# EAGLE design OSO-FEAL-A1-00 (EAGLE 9.6.2)
COMPANY: ADAFRUIT INDUSTRIES; DRAWN: KTOWN; REV: B
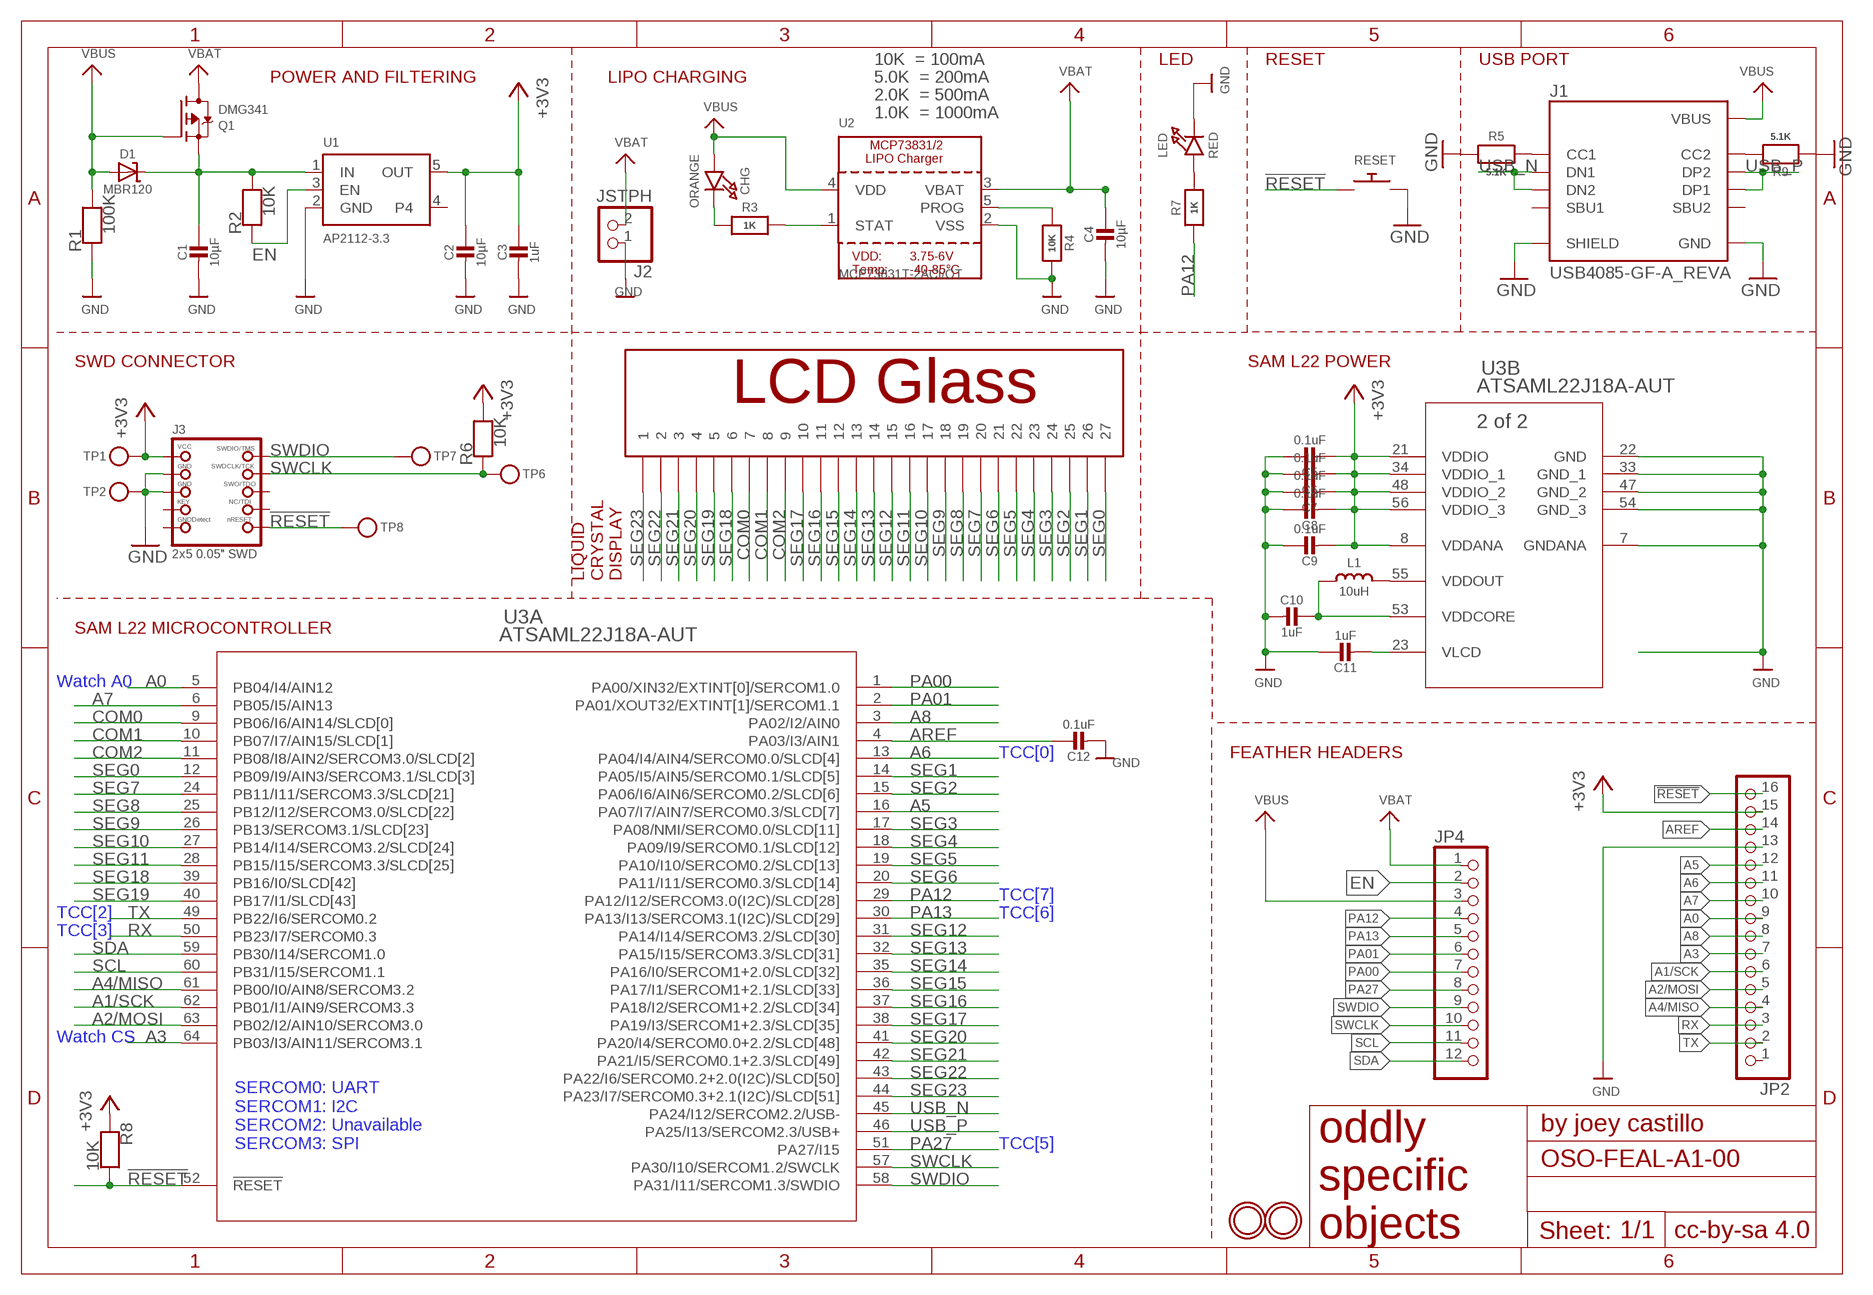
[diagram p0: schematic, sheet 1]

## Parts
C1  10µF  CAP_CERAMIC_1206  [_1206]
C2  10µF  CAP_CERAMIC_1206  [_1206]
C3  1uF  CAP_CERAMIC_1206  [_1206]
C4  10µF  CAP_CERAMIC_1206  [_1206]
C5  0.1uF  CAP_CERAMIC0603_NO  [0603-NO]
C6  0.1uF  CAP_CERAMIC0603_NO  [0603-NO]
C7  0.1uF  CAP_CERAMIC0603_NO  [0603-NO]
C8  0.1uF  CAP_CERAMIC0603_NO  [0603-NO]
C9  0.1uF  CAP_CERAMIC0603_NO  [0603-NO]
C10  1uF  CAP_CERAMIC_1206  [_1206]
C11  1uF  CAP_CERAMIC_1206  [_1206]
C12  0.1uF  CAP_CERAMIC0603_NO  [0603-NO]
CHG  ORANGE  LED0805_NOOUTLINE  [CHIPLED_0805_NOOUTLINE]
D1  MBR120  DIODE-SCHOTTKYSOD-123  [SOD-123]
J1  USB4085-GF-A_REVA  [GCT_USB4085-GF-A_REVA]
J2  JSTPH  CON_JST_PH_2PIN  [JSTPH2]
J3  2x5 0.05" SWD  JTAG-CORTEXBOX  [2X05_1.27MM_BOX_NOPOSTS]
JP2  HEADER-1X16_MIN  [1X16_ROUND_MIN]
JP4  HEADER-1X12_MIN  [1X12_ROUND_MIN]
L1  10uH  MICROBUILDER_INDUCTOR_0805MP  [MICROBUILDER__0805MP]
LED  RED  LED0805_NOOUTLINE  [CHIPLED_0805_NOOUTLINE]
Q1  DMG341  MOSFET-P  [SOT23-R]
R1  100K  RESISTOR_0603_NOOUT  [0603-NO]
R2  10K  RESISTOR_0603_NOOUT  [0603-NO]
R3  1K  RESISTOR_0603_NOOUT  [0603-NO]
R4  10K  RESISTOR_0603_NOOUT  [0603-NO]
R5  5.1K  RESISTOR_0603_NOOUT  [0603-NO]
R6  10K  RESISTOR_0603_NOOUT  [0603-NO]
R7  1K  RESISTOR_0603_NOOUT  [0603-NO]
R8  10K  RESISTOR_0603_NOOUT  [0603-NO]
R9  5.1K  RESISTOR_0603_NOOUT  [0603-NO]
RESET  SWITCH_PUSHBUTTON_3.5X6MM  [TACTILE_3X6MM]
TP1  TESTPOINTROUND2MMNO  [TESTPOINT_ROUND_2MM_NO]
TP2  TESTPOINTROUND2MMNO  [TESTPOINT_ROUND_2MM_NO]
TP6  TESTPOINTROUND2MMNO  [TESTPOINT_ROUND_2MM_NO]
TP7  TESTPOINTROUND2MMNO  [TESTPOINT_ROUND_2MM_NO]
TP8  TESTPOINTROUND2MMNO  [TESTPOINT_ROUND_2MM_NO]
U1  AP2112-3.3  VREG_SOT23-5  [SOT23-5]
U2  MCP73831T-2ACI/OT  MCP73831/2  [SOT23-5]
U3  ATSAML22J18A-AUT  [TQFP64_10X10MC_MCH-L]
U$4  LCD_FEATHER_DISPLAY  [LCD_FEATHER_DISPLAY]
U$31  MOUNTINGHOLE2.5  [MOUNTINGHOLE_2.5_PLATED]
U$32  MOUNTINGHOLE2.5  [MOUNTINGHOLE_2.5_PLATED]

## Nets
!RESET: J3.10(NRESET) JP2.16 R8.2 RESET.P$1 TP8.P$1 U3.52(A:!RESET)
+3V3 [power]: C2.1 C3.1 C5.2 C6.2 C7.2 C8.2 C9.2 J3.1(VCC) JP2.15 R6.2 R8.1 TP1.P$1 U1.5(OUT) U3.8(B:VDDANA) U3.21(B:VDDIO) U3.34(B:VDDIO_1) U3.48(B:VDDIO_2) U3.56(B:VDDIO_3)
A0: JP2.9 U3.5(A:PB04/I4/AIN12)
A1/SCK: JP2.6 U3.62(A:PB01/I1/AIN9/SERCOM3.3)
A2/MOSI: JP2.5 U3.63(A:PB02/I2/AIN10/SERCOM3.0)
A3: JP2.7 U3.64(A:PB03/I3/AIN11/SERCOM3.1)
A4/MISO: JP2.4 U3.61(A:PB00/I0/AIN8/SERCOM3.2)
A5: JP2.12 U3.16(A:PA07/I7/AIN7/SERCOM0.3/SLCD[7])
A6: JP2.11 U3.13(A:PA04/I4/AIN4/SERCOM0.0/SLCD[4])
A7: JP2.10 U3.6(A:PB05/I5/AIN13)
A8: JP2.8 U3.3(A:PA02/I2/AIN0)
AREF: C12.1 JP2.14 U3.4(A:PA03/I3/AIN1)
CHG: CHG.C R3.1
COM0 [lcd]: U3.9(A:PB06/I6/AIN14/SLCD[0]) U$4.P$7
COM1 [lcd]: U3.10(A:PB07/I7/AIN15/SLCD[1]) U$4.P$8
COM2 [lcd]: U3.11(A:PB08/I8/AIN2/SERCOM3.0/SLCD[2]) U$4.P$9
EN: JP4.2 R2.1 U1.3(EN)
GND [gnd]: C1.2 C2.2 C3.2 C4.2 C5.1 C6.1 C7.1 C8.1 C9.1 C10.2 C11.1 C12.2 J1.A1(GND) J1.A12(GND) J1.B1(GND) J1.B12(GND) J1.P1(SHIELD) J1.P2(SHIELD) J1.P3(SHIELD) J1.P4(SHIELD) J2.1 J3.3(GND) J3.5(GND) JP2.13 LED.C R1.1 R4.2 R5.1 R9.2 RESET.P$2 TP2.P$1 U1.2(GND) U2.2(VSS) U3.7(B:GNDANA) U3.22(B:GND) U3.33(B:GND_1) U3.47(B:GND_2) U3.54(B:GND_3)
N$1: LED.A R7.2
N$2: J1.A5(CC1) R5.2
N$3: J1.B5(CC2) R9.1
PA00: JP4.7 U3.1(A:PA00/XIN32/EXTINT[0]/SERCOM1.0)
PA01: JP4.6 U3.2(A:PA01/XOUT32/EXTINT[1]/SERCOM1.1)
PA12: JP4.4 R7.1 U3.29(A:PA12/I12/SERCOM3.0(I2C)/SLCD[28])
PA13: JP4.5 U3.30(A:PA13/I13/SERCOM3.1(I2C)/SLCD[29])
PA27: JP4.8 U3.51(A:PA27/I15)
PROG: R4.1 U2.5(PROG)
RX: JP2.3 U3.50(A:PB23/I7/SERCOM0.3)
SCL: JP4.11 U3.60(A:PB31/I15/SERCOM1.1)
SDA: JP4.12 U3.59(A:PB30/I14/SERCOM1.0)
SEG0 [lcd]: U3.12(A:PB09/I9/AIN3/SERCOM3.1/SLCD[3]) U$4.P$27
SEG1 [lcd]: U3.14(A:PA05/I5/AIN5/SERCOM0.1/SLCD[5]) U$4.P$26
SEG2 [lcd]: U3.15(A:PA06/I6/AIN6/SERCOM0.2/SLCD[6]) U$4.P$25
SEG3 [lcd]: U3.17(A:PA08/NMI/SERCOM0.0/SLCD[11]) U$4.P$24
SEG4 [lcd]: U3.18(A:PA09/I9/SERCOM0.1/SLCD[12]) U$4.P$23
SEG5 [lcd]: U3.19(A:PA10/I10/SERCOM0.2/SLCD[13]) U$4.P$22
SEG6 [lcd]: U3.20(A:PA11/I11/SERCOM0.3/SLCD[14]) U$4.P$21
SEG7 [lcd]: U3.24(A:PB11/I11/SERCOM3.3/SLCD[21]) U$4.P$20
SEG8 [lcd]: U3.25(A:PB12/I12/SERCOM3.0/SLCD[22]) U$4.P$19
SEG9 [lcd]: U3.26(A:PB13/SERCOM3.1/SLCD[23]) U$4.P$18
SEG10 [lcd]: U3.27(A:PB14/I14/SERCOM3.2/SLCD[24]) U$4.P$17
SEG11 [lcd]: U3.28(A:PB15/I15/SERCOM3.3/SLCD[25]) U$4.P$16
SEG12 [lcd]: U3.31(A:PA14/I14/SERCOM3.2/SLCD[30]) U$4.P$15
SEG13 [lcd]: U3.32(A:PA15/I15/SERCOM3.3/SLCD[31]) U$4.P$14
SEG14 [lcd]: U3.35(A:PA16/I0/SERCOM1+2.0/SLCD[32]) U$4.P$13
SEG15 [lcd]: U3.36(A:PA17/I1/SERCOM1+2.1/SLCD[33]) U$4.P$12
SEG16 [lcd]: U3.37(A:PA18/I2/SERCOM1+2.2/SLCD[34]) U$4.P$11
SEG17 [lcd]: U3.38(A:PA19/I3/SERCOM1+2.3/SLCD[35]) U$4.P$10
SEG18 [lcd]: U3.39(A:PB16/I0/SLCD[42]) U$4.P$6
SEG19 [lcd]: U3.40(A:PB17/I1/SLCD[43]) U$4.P$5
SEG20 [lcd]: U3.41(A:PA20/I4/SERCOM0.0+2.2/SLCD[48]) U$4.P$4
SEG21 [lcd]: U3.42(A:PA21/I5/SERCOM0.1+2.3/SLCD[49]) U$4.P$3
SEG22 [lcd]: U3.43(A:PA22/I6/SERCOM0.2+2.0(I2C)/SLCD[50]) U$4.P$2
SEG23 [lcd]: U3.44(A:PA23/I7/SERCOM0.3+2.1(I2C)/SLCD[51]) U$4.P$1
STAT: R3.2 U2.1(STAT)
SWCLK: J3.4(SWDCLK) JP4.10 R6.1 TP6.P$1 U3.57(A:PA30/I10/SERCOM1.2/SWCLK)
SWDIO: J3.2(SWDIO) JP4.9 TP7.P$1 U3.58(A:PA31/I11/SERCOM1.3/SWDIO)
TX: JP2.2 U3.49(A:PB22/I6/SERCOM0.2)
USB_N: J1.A7(DN1) J1.B7(DN2) U3.45(A:PA24/I12/SERCOM2.2/USB-)
USB_P: J1.A6(DP1) J1.B6(DP2) U3.46(A:PA25/I13/SERCOM2.3/USB+)
VBAT [power]: C4.1 J2.2 JP4.1 Q1.3(D) U2.3(VBAT)
VBUS [power]: CHG.A D1.A J1.A4(VBUS) J1.A9(VBUS) J1.B4(VBUS) J1.B9(VBUS) JP4.3 Q1.1(G) R1.2 U2.4(VDD)
VDDCORE [power]: C10.1 L1.1 U3.53(B:VDDCORE)
VDDOUT [power]: L1.2 U3.55(B:VDDOUT)
VHI [power]: C1.1 D1.C Q1.2(S) R2.2 U1.1(IN)
VLCD: C11.2 U3.23(B:VLCD)
Unconnected: J1.A8(SBU1) J1.B8(SBU2) J3.6(SWO) J3.7(KEY) J3.8(TDI) J3.9(GNDDETECT) JP2.1 U1.4

## Notes on the sheet
- 10K  = 100mA | LED | RESET | USB PORT
- POWER AND FILTERING | LIPO CHARGING | 5.0K  = 200mA
- 2.0K  = 500mA
- 1.0K  = 1000mA
- SWD CONNECTOR | SAM L22 POWER
- LIQUID
  CRYSTAL
  DISPLAY
- SAM L22 MICROCONTROLLER
- Watch A0
- TCC[0] | FEATHER HEADERS
- TCC[7]
  TCC[6]
- TCC[2]
  TCC[3]
- Watch CS
- SERCOM0: UART
  SERCOM1: I2C
  SERCOM2: Unavailable
  SERCOM3: SPI
- TCC[5]

## Library data of the parts
C1-C12 = microbuilder:CAP_CERAMIC: Ceramic Capacitors For new designs, use the packages preceded by an '_' character since they are more reliable: The following footprints should be used on most boards: _0402 - Standard footprint for regular board layouts _0603 - Standard footprint for regular board layouts _0805 - Standard footprint for regular board layouts _1206 - Standard footprint for regular board layouts For extremely tight-pitch boards where space is at a premium, the following 'micro-pitch' footprints can be used (smaller pads, no silkscreen outline, etc.): _0402MP - Micro-pitch footprint for very dense/compact boards _0603MP - Micro-pitch footprint for very dense/compact boards _0805MP - Micro-pitch footprint for very dense/compact boards _1206MP - Micro-pitch footprint for very dense/compact boards
CHG LED = microbuilder:LED: LED 0603 - 0603 Surface Mount Package 2mA: Green LED - Low Power (3.9mcd, 2ma, 1.7Vf) - Digikey: 475-2709-2-ND Orange LED - Low Power (9.8mcd, 2ma, 1.8Vf) - Digikey: 475-1194-2-ND Red LED - Low Power (5mcd, 2ma, 1.8Vf) - Digikey: 475-1195-2-ND Yellow LED - Low Power (7mcd, 2ma, 1.8Vf) - Digikey: 475-1196-2-ND 5mA: Blue LED - Low Power (17mcd, 5ma, 2.9Vf) - Digikey: LNJ937W8CRACT-ND 0805 - 0805 Surface Mount Package 2mA: Red LED (8.8mcd, 2mA, 1.8Vf, Clear) - Low Power [Digikey: 475-2510-1-ND] Green LED (5mcd, 2mA, 1.8Vf, Clear) - Low Power [Digikey: 475-2730-1-ND] Yellow LED (11.3mcd, 2mA, 1.8Vf, Clear) - Low Power [Digikey: 475-2555-1-ND] 20mA: Red LED (104mcd, 20mA, Diffused) - LS R976 [Digikey: 475-1278-6-ND] Red LED (12mcd, 20mA, 2.0Vf, Clear) - APT2012EC [Digikey: 754-1128-1-ND] Green LED (15mcd, 20mA, 2.2Vf, Clear) - APT2012GC [Digikey: 754-1131-1-ND] Orange LED (160mcd, 20mA, 2.1Vf, Clear) - APT2012SECK [Digikey: 754-1130-1-ND] 1206 - 1206 Surface Mount Package Green LED (26mcd, 20mA, Diffused) - LG N971 [Digikey: 475-1407-6-ND] Red LED (15mcd, 20mA, Diffused) - LH N974 [Digikey: 475-1416-6-ND] Cree - Cree High-Power Surface Mount LEDs XPEBWT-L1-0000-00D50 - White 111lm 350mA 2.9Vf 6200K 110° XTEAWT-00-0000-00000LEE3 - White 114lm 350mA 2.85Vf 5000K 115° Everlight - Everlight 45-21 Series Surface Mount LEDs 45-21/QK2C-B2832AC2CB2/2T - Warm White 2000mcd 20mA 3.25Vf 3050K 120° 45-21/LK2C-B38452C4CB2/2T - Nuetral White 2000mcd 20mA 3.25Vf 4150K 120° 45-21/LK2C-B50634C6CB2/2T - Cold White 2200mcd 20mA 3.25Vf 5650K 120° PLCC2 Reverse Mount LS T77K-J1L2-1-0-2-R18-Z - Red 11.25mcd 2mA 1.8Vf 630nm 120° LO T77K-L1M2-24-Z - Orange 19.6mcd 2mA 1.8Vf 606nm 120° LY T77K-K2M1-26-Z - Yellow 15.7mcd 2mA 1.8Vf 587nm 120°
D1 = microbuilder:DIODE-SCHOTTKY
J1 = USB4085-GF-A_REVA:USB4085-GF-A_REVA: USB 2.0 Type C Receptacle Dip Type, PCB Top Mount; DESCRIPTION: USB-C (USB TYPE-C) USB 2.0 Receptacle Connector 24 (16+8 Dummy) Position Through Hole, Right Angle, low cost, 3.46mm profile, 16 pin, horizontal, Top mount; DIGI-KEY_PART_NUMBER: 2073-USB4085-GF-ACT-ND; MF: Global Connector Technology; MP: USB4085-GF-A; PACKAGE: Package; PURCHASE-URL: https://pricing.snapeda.com/search/part/USB4085-GF-A/?ref=eda
J2 = microbuilder:CON_JST_PH_2PIN: JST 2-Pin Right-Angle Connector PH-Series - 4UConnector: 17311 SH-Series - 4UConnector: 07278
J3 = microbuilder:JTAG-CORTEX: Serial Wire (SW-DP) Connector Standard 0.05" 10-pin connector is for use with the Cortex M and Cortex A SWD (serial wire debugger) interface (SW-DP) Connectors 2x05_1.27MM_SMT - Inexpensive surface-mount header with bare pins, compatible with standard 10-pin SWD cables (4UCON: 16846) 2x05_1.27MM_BOX_NOPOSTS - Polarised surface-mount box (4UCON with caps: 19735, without caps: 15117 2x05_1.27MM_BOX_POSTS - Polarised surface-mount box with mounting holes (4UCON: 20317) Pinout: http://infocenter.arm.com/help/topic/com.arm.doc.faqs/attached/13634/cortex_debug_connectors.pdf http://www.keil.com/peripherals/coresight/connectors.asp
JP2 = microbuilder:HEADER-1X16: PIN HEADER
JP4 = microbuilder:HEADER-1X12
L1 = Adafruit 3.5in 480x320 FeatherWing:MICROBUILDER_INDUCTOR: Inductors 0603: 10nH Ceramic Inductor - microwire antenna/RF (Digikey: 712-1434-2-ND) 0805: 560nH Ceramic Inductor - RF (Digikey: 553-1047-1-ND) 270nH Ceramic Inductor - Q = 40@250MHz, +-5%, 1 Ohm DC Resistance (Digikey: 535-10506-2-ND) 1007 (2518 Metric) SMT: 10µH 10% 250mOhm 820mA 1007 Inductor (Digikey: 587-2189-1-ND) 22µH 10% 500mOhm 580mA 1007 Inductor (Digikey: 587-2190-1-ND) 47µH 10% 950mOhm 420mA 1007 Inductor (Digikey: 587-2191-1-ND) 47µH 5% 100mOhm 1A 1008 Inductor (Digikey: 732-1816-1-ND) 5.0x5.0mm (Taiyo Yuden NR5040 Series) 6.8µH 20% 2.3A 64mOhm Inductor (Digikey: 587-2374-2-ND) 5.0x5.0mm (TDK VLC5045 Series) 4.7µH 20% 3.3A 34mOhm Inductor (Digikey: 445-6526-1-ND) 6.8µH 20% 2.7A 46mOhm Inductor (Digikey: 445-6527-1-ND) 6.0x6.0mm (TDK VLC6045 Series) 4.7µH 20% 3.8A 27mOhm Inductor (Digikey: 445-6538-2-ND) 6.8µH 20% 3A 41mOhm Inductor (Digikey: 445-6540-1-ND) 6.2µH 30% 2.2A 45mOhm Inductor (Digikey: SRR5028-6R2YCT-ND) - Not TDK VLC6045 but footprint should match 6.0x6.0mm (TDK SLF6045 Series) 6.8uH 30% 2A 33mOhm Inductor (Digikey: 445-4572-1-ND, Mouser: 810-SLF645T6R8N2R0PF) 6.0x6.0mm (Sumida CDRH5D28 Series) 6.2uH 30% 1.8A 45mOhm Inductor (Digikey: 308-1542-1-ND) Taiyo Yuden NR3015T2R2M - 2.2uH 20% 1.5A (Digikey: 587-1648-2-ND, Mouser: 963-NR3015T2R2M) - Used with TI TPS62172 CoilCraft RFID Transponder Coil - MA5532-AE (For use with AS3935 Lightning Sensor) Taiyo Yuden NRH2412T2R2MNGH - 2.2uH 20% 1AA (Digikey: 587-3443-1-ND) - Used with TI LM3671 Vishay IHLP 1.0uH Molded Inductor - 24mOhm DCR, 5A, +/-20%, -55°C-125°C (Digikey: 541-1319-1-ND)
Q1 = microbuilder:MOSFET-P: P-Channel Mosfet LEGEND VDS: Voltage Drain-Source ID: Drain Current RDS(ON): Drain-Source On-State Resistance VGS(TH): Gate-Source Threshold Voltage CISS: Drain-Source Input Capacitance SOT-23 Name VDS ID RDS(ON) VGS(TH) CISS Order Number IRLML5103 30V 760mA 600 mOhm -- 75pF @ 25V Digikey: IRLML5103PBFCT-ND IRLML6401 12V 4.3A 50 mOhm 950mV @ 250µA 830pF @ 10V Digikey: IRLML6401PBFTR-ND NTR0202PL 20V 400mA 800 mOhm 2.3V @ 250uA 70pF @ 5V Digikey: NTR0202PLT1GOSTR-ND NTR4101PT1G 20V 1.8A 85 mOhm 1.2V @ 250uA 675pF @ 10V Digikey: NTR4101PT1GOSCT-ND DMP2004K 20V 600mA 900 mOhm 1V @ 250uA 175pF @ 16V Digikey: DMP2004KDICT-ND PMV65XP 20V 3.9A 76 mOhm 950mV @ 1mA 725pF @ 20V Digikey: 568-2358-2-ND TO-252 Name VDS ID RDS(ON) VGS(TH) CISS Order Number AOD417 30V 25A 34 mOhm 3V @ 250µA 920pF @ 15V Digikey: 785-1106-2-ND PowerPak Name VDS ID RDS(ON) VGS(TH) CISS Order Number AON7401 30V 12A 14 mOhm 3V @ 250µA 2600pF @ 15V Digikey: 785-1302-1-ND
R1-R9 = microbuilder:RESISTOR: Resistors For new designs, use the packages preceded by an '_' character since they are more reliable: The following footprints should be used on most boards: _0402 - Standard footprint for regular board layouts _0603 - Standard footprint for regular board layouts _0805 - Standard footprint for regular board layouts _1206 - Standard footprint for regular board layouts For extremely tight-pitch boards where space is at a premium, the following 'micro-pitch' footprints can be used (smaller pads, no silkscreen outline, etc.): _0402MP - Micro-pitch footprint for very dense/compact boards _0603MP - Micro-pitch footprint for very dense/compact boards _0805MP - Micro-pitch footprint for very dense/compact boards _1206MP - Micro-pitch footprint for very dense/compact boards
RESET = microbuilder:SWITCH_PUSHBUTTON: Buttons SOFTTOUCHSMD_SJ - Soft touch temporary push button (Super Junk Akihabara) Compatible with SKPMANE010 [Mouser: 688-SKPMAN] C&K_KSS = Digikey: KSS221GLFS
TP1 TP2 TP6-TP8 = microbuilder:TESTPOINT: Test Point Various test points for characterisation and PCB testing TESTPOINT_SMT - Compact Surface Mount Test Point [Digikey: 5016KTR-ND]
U1 = microbuilder:VREG_SOT23-5: SOT23-5 Fixed Voltage Regulators Part Current Out V Out V In V Dropout θJA (°C/W) TJ (°C) Digikey Part No. ADP121 150mA 3.3V 3.4-5.5V 0.09V @ 150mA -- -- ADP121-AUJZ33R7CT-ND ADP121 150mA 3.0V 3.1-5.5V 0.09V @ 150mA -- -- ADP121-AUJZ30R7CT-ND ADP122 300mA 3.3V 3.4-5.5V 0.085V @ 300mA -- -- ADP122AUJZ-3.3-R7CT-ND ADP1712 300mA 3.3V 3.5-5.5V 0.17V @ 300mA -- -- ADP1712AUJZ-3.3-R7TR-ND AP7311 (Low Cost) 150mA 3.3V 3.5-6V 0.15V @ 150mA -- -- AP7311-33WG-7DICT-ND LD39015M18R 150mA 1.8V 1.9V-5.5V 0.08V @ 100mA -- -- 497-6977-1-ND LP2985A-33DBVR 150mA 3.3V 3.3-16V 0.28V @ 150mA 206 150 296-18479-1-ND MCP1824T-3302E/OT 300mA 3.3V 3.5V-6V 0.2V @ 300mA -- -- MCP1824T-3302E/OTCT-ND MIC5205-2.5YM5 TR 150mA 2.5V 2.7-16V 0.165V @ 150mA -- -- 576-1257-2-ND MIC5205-3.0YM5 TR 150mA 3.0V 3.2V-16V 0.165V @ 150mA -- -- 576-1258-2-ND MIC5205-3.3YM5 TR 150mA 3.3V 3.5V-16V 0.165V @ 150mA -- -- 576-1259-2-ND TPS780330220 150mA 3.3V+2.2V 3.6-5.5V 250mV Max -- -- 296-23332-1-ND TDA3663/N1,135 100mA 3.3V 3.5-45V 0.18V @ 50mA -- -- 568-5343-1-ND Max operating temp can be calculated using θJA, TJ (max junction temperature), and power in watts. Set the "Maximum Ambient Temperature" until it reaches TJ ("Max Junction Temperature"), which is the absolute limit for safe use of the regulator: Heat Sink Temperature Calculator <http://www.daycounter.com/Calculators/Heat-Sink-Temperature-Calculator.phtml> For example, With 12V source into a 3.3V LP2985 and a 30mA load, we are dissipating (12V-3.3V) * 0.03A = 0.261W. With a θJA of 206 °C/W, a TJ of 150°C, and 261mW we can safely use the chip without a heat sink up to 75°C (=147.1°C Junction Temperature).
U2 = microbuilder:MCP73831/2: MCP73831/2 LIPO Charger VDD: 3.75 - 6V Temp -40 - 85°C Programmable Charge Rate: 15-500mA NOTE: STAT is a tri-state logic output on the MCP73831 and an open-drain output on the MCP73832. SOT23-5 with 4.2V output and tri-state logic on STAT = MCP73831T-2ACI/OT
U3 = ATSAML22:ATSAML22J18A-AUT
U$4 = My Stuff:LCD_FEATHER_DISPLAY
U$31 U$32 = microbuilder:MOUNTINGHOLE: Mounting Hole For #2 screws (0.086"/2.18mm width, 0.094"/2.4mm hole) use 2.5mm; BOM: EXCLUDE

## Net classes
0 default: width 0.203 mm, drill 0.254 mm
1 power: width 0.305 mm, drill 0.254 mm
2 gnd: width 0.305 mm, drill 0.254 mm
3 lcd: width 0.152 mm, drill 0.254 mm

## Board
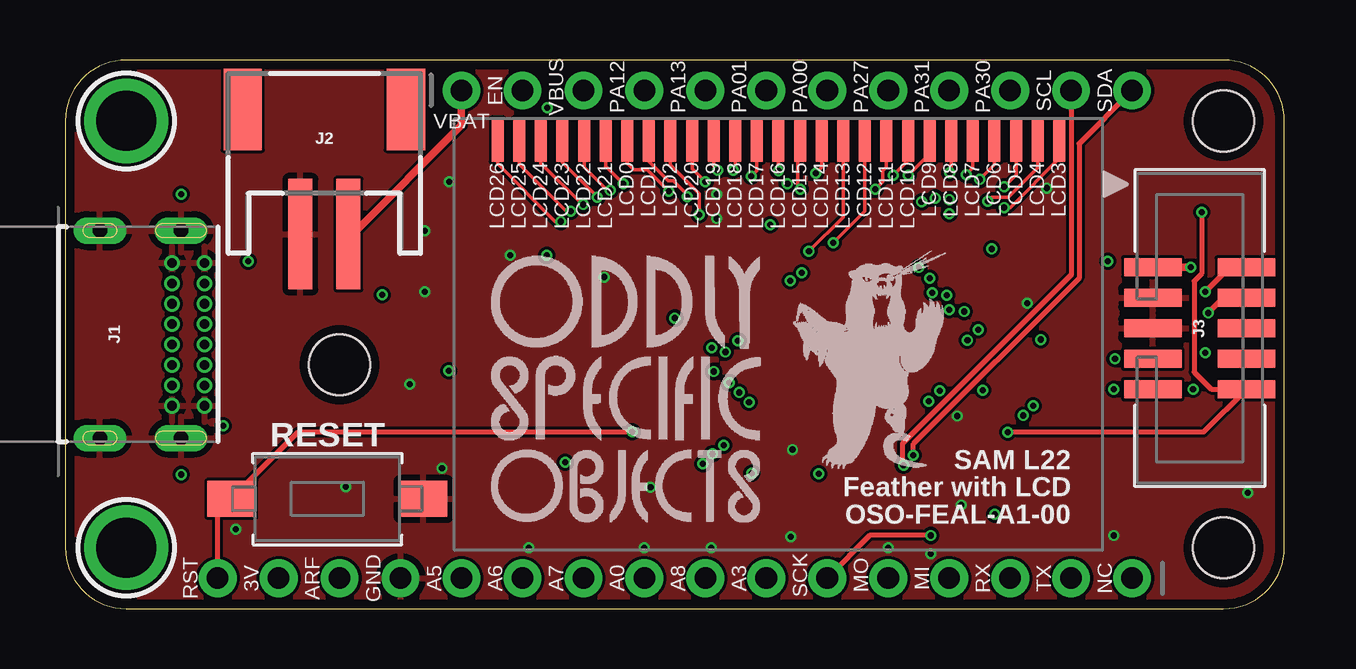
[diagram p1: board, top side]
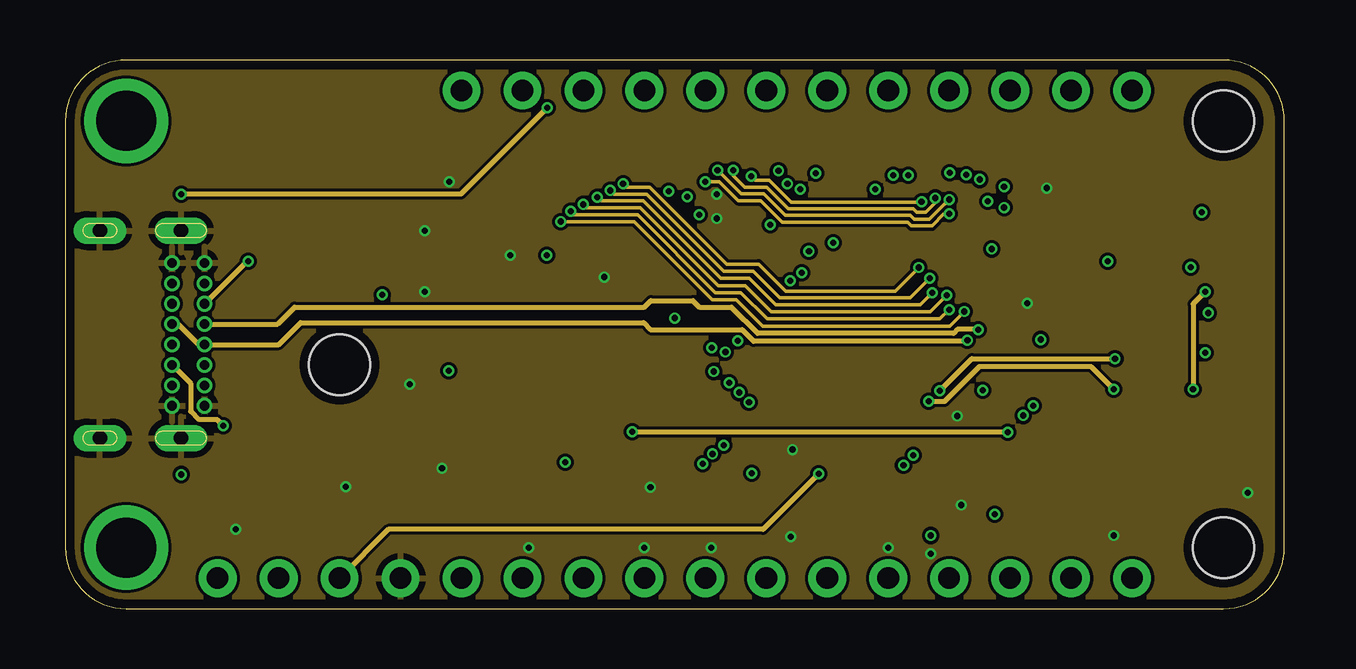
[diagram p2: board, inner layer Route2]
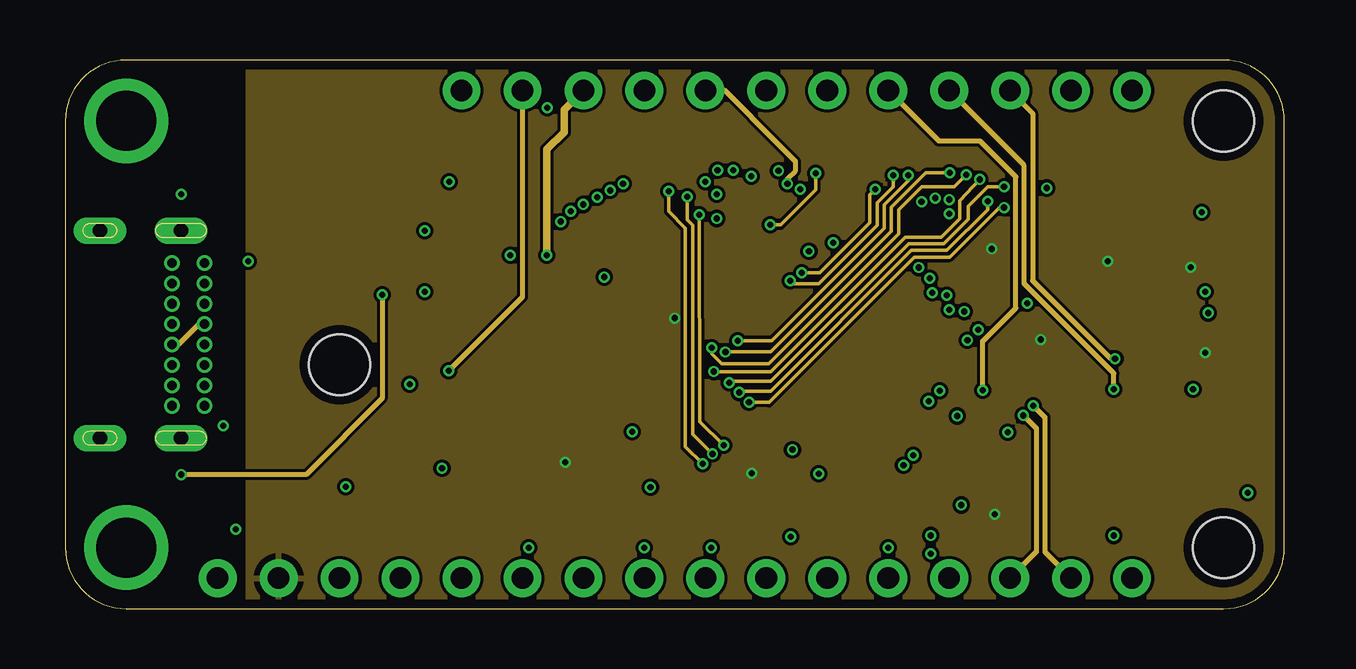
[diagram p3: board, inner layer Route15]
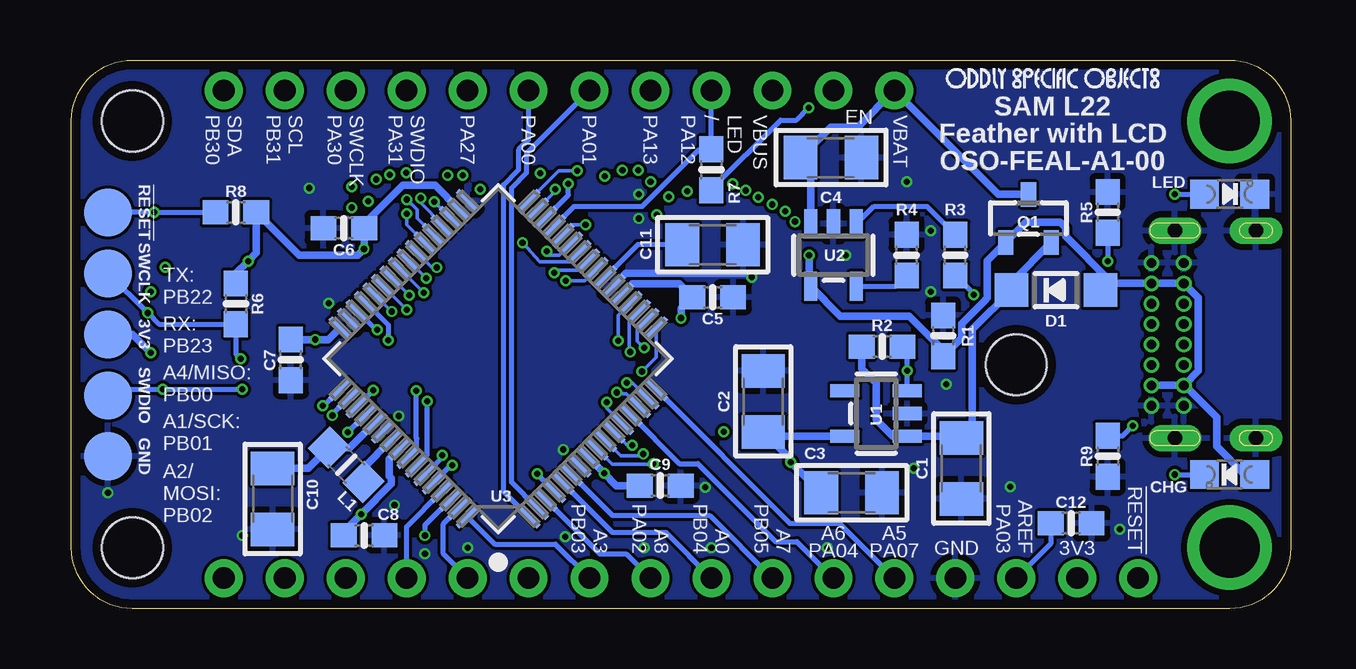
[diagram p4: board, bottom side, seen from below]

Size 50.8 x 22.86 mm. Coordinates in mm from the lower left corner, seen from the top.
Outline: 2.54,0 48.26,0 arc90 50.8,2.54 50.8,20.32 arc90 48.26,22.86 2.54,22.86 arc90 0,20.32 0,2.54 arc90 2.54,0
Copper layers (1+2*15+16): Top 0.035559375mm / dielectric 0.17018125mm / Route2 0.01778125mm / dielectric 47mil / Route15 0.01778125mm / dielectric 0.17018125mm / Bottom 0.035559375mm
Design rules "oshpark-4layer *": minimum track width 5mil, minimum drill 10mil, track to track 5mil, track to pad 5mil, pad to pad 5mil, via to via 5mil, smd to smd 5mil, copper to edge 15mil, drill to drill 6mil, minimum pad ring 4mil, minimum via ring 4mil, stop-mask expansion 1.5mil, vias tented up to drill 12mil, thermal gap 10mil
Holes 2.54 mm at 48.26,2.54 48.26,20.32 11.43,10.16

### Footprints (pad centres in the part's own frame; a part is rotated, then mirrored left to right if it is on the bottom)
_1206 = smd 1.4 x 1.8: 1 -1.27,0; 2 1.27,0
0603-NO = smd 1.075 x 1: 1 -0.85,0; 2 0.85,0
CHIPLED_0805_NOOUTLINE = smd 1.2 x 1.2: A 0,-1.05; C 0,1.05
SOD-123 = smd 1.4 x 1.4: A 1.85,0; C -1.85,0
GCT_USB4085-GF-A_REVA = drill 0.4 pad 0.65: A1 -2.975,4.025; A4 -2.125,4.025; A5 -1.275,4.025; A6 -0.425,4.025; A7 0.425,4.025; A8 1.275,4.025; A9 2.125,4.025; A12 2.975,4.025; B1 2.975,2.675; B4 2.125,2.675; B5 1.275,2.675; B6 0.425,2.675; B7 -0.425,2.675; B8 -1.275,2.675; B9 -2.125,2.675; B12 -2.975,2.675 | drill 0.6 pad 1.108 long: P1 -4.325,3.045; P2 4.325,3.045; P3 4.325,-0.335; P4 -4.325,-0.335
JSTPH2 = smd 1 x 4.6: 1 -1,-3.7; 2 1,-3.7 | smd 1.6 x 3.4: NC1 -3.4,1.5; NC2 3.4,1.5
2X05_1.27MM_BOX_NOPOSTS = smd 0.76 x 2.4: 1 -2.54,-1.95; 2 -2.54,1.95; 3 -1.27,-1.95; 4 -1.27,1.95; 5 0,-1.95; 6 0,1.95; 7 1.27,-1.95; 8 1.27,1.95; 9 2.54,-1.95; 10 2.54,1.95
1X16_ROUND_MIN = drill 0.9 pad 1.575: 1 -19.05,0; 2 -16.51,0; 3 -13.97,0; 4 -11.43,0; 5 -8.89,0; 6 -6.35,0; 7 -3.81,0; 8 -1.27,0; 9 1.27,0; 10 3.81,0; 11 6.35,0; 12 8.89,0; 13 11.43,0; 14 13.97,0; 15 16.51,0; 16 19.05,0
1X12_ROUND_MIN = drill 0.9 pad 1.575: 1 -13.97,0; 2 -11.43,0; 3 -8.89,0; 4 -6.35,0; 5 -3.81,0; 6 -1.27,0; 7 1.27,0; 8 3.81,0; 9 6.35,0; 10 8.89,0; 11 11.43,0; 12 13.97,0
MICROBUILDER__0805MP = smd 1.2 x 1.3: 1 -1.016,0; 2 1.016,0
SOT23-R = smd 0.635 x 1.016: 1 -0.95,-1; 2 0.95,-1; 3 0,1
TACTILE_3X6MM = smd 2 x 1.5: P$1 -4,0; P$2 4,0
TESTPOINT_ROUND_2MM_NO = smd 2 x 2: P$1 0,0
SOT23-5 = smd 0.55 x 1.2: 1 -0.95,-1.3; 2 0,-1.3; 3 0.95,-1.3; 4 0.95,1.3; 5 -0.95,1.3
TQFP64_10X10MC_MCH-L = smd 1.168 x 0.229: 1 -5.563,3.75; 2 -5.563,3.25; 3 -5.563,2.75; 4 -5.563,2.25; 5 -5.563,1.75; 6 -5.563,1.25; 7 -5.563,0.75; 8 -5.563,0.25; 9 -5.563,-0.25; 10 -5.563,-0.75; 11 -5.563,-1.25; 12 -5.563,-1.75; 13 -5.563,-2.25; 14 -5.563,-2.75; 15 -5.563,-3.25; 16 -5.563,-3.75; 33 5.563,-3.75; 34 5.563,-3.25; 35 5.563,-2.75; 36 5.563,-2.25; 37 5.563,-1.75; 38 5.563,-1.25; 39 5.563,-0.75; 40 5.563,-0.25; 41 5.563,0.25; 42 5.563,0.75; 43 5.563,1.25; 44 5.563,1.75; 45 5.563,2.25; 46 5.563,2.75; 47 5.563,3.25; 48 5.563,3.75 | smd 0.229 x 1.168: 17 -3.75,-5.563; 18 -3.25,-5.563; 19 -2.75,-5.563; 20 -2.25,-5.563; 21 -1.75,-5.563; 22 -1.25,-5.563; 23 -0.75,-5.563; 24 -0.25,-5.563; 25 0.25,-5.563; 26 0.75,-5.563; 27 1.25,-5.563; 28 1.75,-5.563; 29 2.25,-5.563; 30 2.75,-5.563; 31 3.25,-5.563; 32 3.75,-5.563; 49 3.75,5.563; 50 3.25,5.563; 51 2.75,5.563; 52 2.25,5.563; 53 1.75,5.563; 54 1.25,5.563; 55 0.75,5.563; 56 0.25,5.563; 57 -0.25,5.563; 58 -0.75,5.563; 59 -1.25,5.563; 60 -1.75,5.563; 61 -2.25,5.563; 62 -2.75,5.563; 63 -3.25,5.563; 64 -3.75,5.563
LCD_FEATHER_DISPLAY = smd 0.5 x 1.8: P$1 -11.7,8.1; P$2 -10.8,8.1; P$3 -9.9,8.1; P$4 -9,8.1; P$5 -8.1,8.1; P$6 -7.2,8.1; P$7 -6.3,8.1; P$8 -5.4,8.1; P$9 -4.5,8.1; P$10 -3.6,8.1; P$11 -2.7,8.1; P$12 -1.8,8.1; P$13 -0.9,8.1; P$14 0,8.1; P$15 0.9,8.1; P$16 1.8,8.1; P$17 2.7,8.1; P$18 3.6,8.1; P$19 4.5,8.1; P$20 5.4,8.1; P$21 6.3,8.1; P$22 7.2,8.1; P$23 8.1,8.1; P$24 9,8.1; P$25 9.9,8.1; P$26 10.8,8.1; P$27 11.7,8.1
MOUNTINGHOLE_2.5_PLATED = drill 2.5 pad 3.2: P$1 0,0

### Placement (x,y rotation side)
C1  13.72,5.84 270 bottom
C2  21.97,8.64 90 bottom
C3  18.29,4.83 0 bottom
C4  19.15,18.8 0 bottom
C5  24.08,12.98 180 bottom
C6  39.45,15.85 0 bottom
C7  41.66,10.36 90 bottom
C8  38.61,3.05 180 bottom
C9  26.26,5.13 180 bottom
C10  42.42,4.57 270 bottom
C11  24.08,15.16 180 bottom
C12  9.14,3.56 0 bottom
CHG  2.54,5.59 90 bottom
D1  9.78,13.27 0 bottom
J1  1.78,11.43 270 top
J2  10.79,19.3 0 top
J3  47.27,11.68 270 top
JP2  25.4,1.27 180 top
JP4  30.48,21.59 0 top
L1  39.34,5.99 315 bottom
LED  2.54,17.27 270 bottom
Q1  10.92,16.26 0 bottom
R1  14.48,11.37 270 bottom
R2  17.02,10.92 180 bottom
R3  13.97,14.73 90 bottom
R4  16,14.73 90 bottom
R5  7.62,16.51 270 bottom
R6  43.94,12.7 90 bottom
R7  24.13,18.29 270 bottom
R8  43.94,16.51 180 bottom
R9  7.62,6.35 270 bottom
RESET  10.92,4.57 0 top
TP1  49.28,11.43 0 bottom
TP2  49.28,6.35 0 bottom
TP6  49.28,13.97 0 bottom
TP7  49.28,8.89 0 bottom
TP8  49.28,16.51 0 bottom
U1  17.27,8.13 90 bottom
U2  19.05,14.73 180 bottom
U3  33.02,10.41 135 bottom
U$4  29.72,11.43 0 top
U$6  [OSO_WORDMARK_THREELINE_450MIL_1000DPI]  23.37,9.14 0 top
U$9  [OSO_BEAR_250X360MIL_1000DPI]  33.53,10.41 0 top
U$12  [OSO_WORDMARK_ONELINE_350MIL_1000DPI]  9.91,22.1 0 bottom
U$31  2.54,20.32 270 top
U$32  2.54,2.54 270 top

### Tracks (layer width: path | path; a pad name or v marks a point on that pad's centre or on a via)
!RESET  (via drill 0.25)
  Top 0.203: JP2.16 6.35,4 RESET.P$1 9.72,7.37 v23.62,7.37 | v39.28,7.35 47.42,7.35 J3.10 47.75,9.14 47.04,9.86 47.04,13.65 47.35,13.96 v47.35,16.51
  Route2 0.203: v39.28,7.35 23.64,7.35 v23.62,7.37
  Bottom 0.203: U3.52 38.56,8.07 v39.28,7.35 | R8.2 v47.35,16.51 TP8.P$1
+3V3  (via drill 0.25)
  Top 0.305: J3.1 v46.89,14.22
  Bottom 0.305: U3.34 35.65,17.64 36.99,17.64 38.6,16.03 C6.2 38.6,14.97 v38.61,14.99 38.86,14.73 41.31,14.73 R8.1 43.09,14.82 v43.43,14.48 43.94,13.97 R6.2 | U3.8 v28.6,5.64 28.09,5.13 C9.2 | U3.56 37.55,6.24 37.55,5.51 37.46,5.43 37.46,5.2 v38.73,3.93 39.46,3.2 C8.2 | U3.21 27.43,13.53 25.48,13.53 C5.2 25.4,12.51 v25.4,12.11 | U3.48 40.09,11.21 v40.64,11.21 C7.2 | TP1.P$1 48.26,11.43 v47.5,10.67 | C3.1 v20.83,6.1 20.83,6.22 C2.1 21.78,7.18 U1.5
  pour Route15: 7.62,22.86 7.62,0 50.93,0 50.93,22.86
A0
  Bottom 0.203: U3.5 28.26,3.17 26.04,3.17 JP2.9
A1/SCK  (via drill 0.25)
  Top 0.203: v36.07,3.05 33.53,3.05 JP2.6
  Bottom 0.203: U3.62 36.07,3.48 v36.07,3.05
A2/MOSI
  Bottom 0.203: JP2.5 35.31,2.29 35.31,3.53 U3.63
A3
  Bottom 0.203: U3.64 33.16,2.69 30.63,2.69 JP2.7
A4/MISO
  Bottom 0.203: JP2.4 36.83,3.42 U3.61
A5
  Bottom 0.203: U3.16 20.86,3.56 18.8,3.56 JP2.12
A6
  Bottom 0.203: U3.13 25.46,6.04 24.7,6.04 21.46,2.79 20.57,2.79 JP2.11
A7
  Bottom 0.203: U3.6 28.26,3.89 24.21,3.89 JP2.10
A8
  Bottom 0.203: U3.3 28.78,2.29 27.69,2.29 JP2.8
AREF  (via drill 0.25)
  Route2 0.203: v31.39,5.61 29.08,3.3 13.46,3.3 JP2.14
  Bottom 0.203: U3.4 v31.39,5.61 | C12.1 9.99,2.71 JP2.14
CHG  (via drill 0.25)
  Route15 0.203: v13.21,13.08 13.21,8.76 10.03,5.59 v4.83,5.59
  Bottom 0.203: R3.1 13.21,13.12 v13.21,13.08 | v4.83,5.59 CHG.C
COM0  (via drill 0.25)
  Top 0.152: U$4.P$7 23.42,18.56 23.69,18.29 24.26,18.29 v25.15,17.4
  Route15 0.152: v26.55,6.03 25.84,6.74 25.84,15.85 25.15,16.55 v25.15,17.4
  Bottom 0.152: v26.55,6.03 26.57,6.01 28.27,6.01 U3.9
COM1  (via drill 0.25)
  Top 0.152: v25.91,17.17 25.91,17.25 25.33,17.83 25.13,17.83 24.32,18.64 U$4.P$8
  Route15 0.152: v25.91,17.17 25.91,16.21 26.14,15.98 26.14,15.49 26.14,7.27 v26.97,6.45
  Bottom 0.152: U3.10 27.92,6.38 27.04,6.38 v26.97,6.45
COM2  (via drill 0.25)
  Top 0.152: v26.42,16.41 26.42,17.3 25.22,18.49 U$4.P$9
  Route15 0.152: v26.42,16.41 26.44,7.8 v27.43,6.81
  Bottom 0.152: U3.11 27.64,6.81 v27.43,6.81
EN  (via drill 0.25)
  Route15 0.203: JP4.2 19.05,12.98 v15.97,9.91
  Bottom 0.203: U1.3 v15.97,9.91 15.97,10.73 R2.1
GND  (via drill 0.25)
  Bottom 0.305: U3.22 27.7,13.97 22.61,13.97 v22.45,13.82
  other vias: 15.7,5.84 14.99,13.21 14.35,9.35 37.34,4.32 49.28,4.83 40.89,17.53 24.38,5.05 16,17.78 14.99,15.75 18.54,14.73 11.68,5.08 7.11,3.3 43.69,3.05 27.15,17.27 19.3,2.54 24.13,2.54 26.92,2.54 30.23,3 34.29,2.54 36.07,2.29 40.08,12.73 37.16,8.03 30.3,6.63 27.15,16.26
  pour Top: -0.25,22.86 -0.25,0 50.93,0 50.93,22.86
  pour Bottom: 0,0 51.18,0 51.18,22.86 0,22.86
  pour Route2: 0,0 51.18,0 51.18,22.86 0,22.86
N$1  (via drill 0.25)
  Route2 0.203: v20.07,20.87 16.48,17.27 v4.83,17.27
  Bottom 0.203: v20.07,20.87 20.58,20.36 21.25,20.36 24.13,17.48 R7.2 | v4.83,17.27 LED.A
N$2  (via drill 0.25)
  Route2 0.203: v7.62,14.48 7.58,14.48 J1.A5
  Bottom 0.203: R5.2 v7.62,14.48
N$3  (via drill 0.25)
  Route2 0.203: J1.B5 5.22,9.39 5.22,8.21 5.56,7.87 6.33,7.87 v6.58,7.62
  Bottom 0.203: R9.1 7,7.2 v6.58,7.62
PA00
  Bottom 0.203: U3.1 32.81,4.9 32.81,17.64 32.17,18.28 32.17,19.11 31.75,19.53 JP4.7
PA01
  Bottom 0.203: U3.2 32.46,5.26 32.46,15.75 | JP4.6 31.84,18.96 31.84,18.14 32.46,17.52 32.46,15.75 | 32.46,15.75
PA12
  Bottom 0.203: U3.29 29.85,16.76 27.01,16.76 24.64,19.14 R7.1 JP4.4
PA13  (via drill 0.25)
  Route15 0.203: v30.09,17.71 30.09,17.91 30.43,18.25 30.43,18.63 29.74,19.32 27.47,21.59 JP4.5
  Bottom 0.203: U3.30 30.09,17.23 v30.09,17.71
PA27  (via drill 0.25)
  Route15 0.203: v38.22,9.1 38.22,11.14 39.61,12.53 39.61,18 38.11,19.49 36.39,19.49 JP4.8
  Bottom 0.203: U3.51 v38.22,9.1
PROG
  Bottom 0.203: U2.5 16.45,13.43 R4.1
RX  (via drill 0.25)
  Route15 0.203: JP2.3 40.46,2.36 40.46,7.51 v39.92,8.05
  Bottom 0.203: U3.50 39.92,8.11 v39.92,8.05
SCL  (via drill 0.25)
  Top 0.203: JP4.11 41.91,13.9 34.88,6.88 34.88,6.2 34.93,6.15 v34.93,5.97
  Bottom 0.203: U3.60 35.02,5.94 34.96,5.94 v34.93,5.97
SDA  (via drill 0.25)
  Top 0.203: v35.34,6.38 35.34,6.87 42.24,13.77 42.24,19.38 JP4.12
  Bottom 0.203: U3.59 35.37,6.3 35.37,6.36 v35.34,6.38
SEG0  (via drill 0.25)
  Top 0.152: U$4.P$27 41.42,18.76 39.37,16.71 v39.12,16.71
  Route15 0.152: v28.49,8.59 29.33,8.59 35.38,14.65 36.84,14.65 38.91,16.71 v39.12,16.71
  Bottom 0.152: U3.12 28.49,8.36 v28.49,8.59
SEG1  (via drill 0.25)
  Top 0.152: v38.43,16.97 38.61,17.14 39.3,17.14 40.52,18.37 U$4.P$26
  Route15 0.152: v28.08,9.01 28.13,9.06 29.39,9.06 35.26,14.93 36.73,14.93 38.43,16.63 v38.43,16.97
  Bottom 0.152: U3.14 27.68,8.96 27.85,8.96 27.9,9.01 v28.08,9.01
SEG2  (via drill 0.25)
  Top 0.152: U$4.P$25 39.62,18.08 v39.12,17.58
  Route15 0.152: v27.66,9.42 27.71,9.47 29.4,9.47 35.14,15.21 36.61,15.21 37.63,16.22 37.63,16.78 38.43,17.58 v39.12,17.58
  Bottom 0.152: U3.15 27.43,9.42 v27.66,9.42
SEG3  (via drill 0.25)
  Top 0.152: U$4.P$24 38.72,18.5 v38.1,17.88
  Route15 0.152: v27.03,9.88 29.4,9.88 35,15.48 36.5,15.48 37.26,16.25 37.26,17 v38.1,17.88
  Bottom 0.152: v27.03,9.88 26.43,10.47 U3.17
SEG4  (via drill 0.25)
  Top 0.152: U$4.P$23 37.82,18.36 v37.54,18.09
  Route15 0.152: v26.94,10.87 26.94,10.62 27.34,10.21 29.31,10.21 34.73,15.63 34.73,16.62 35.68,17.58 37.03,17.58 v37.54,18.09
  Bottom 0.152: v26.94,10.87 27.22,11.15 27.22,11.62 U3.18
SEG5  (via drill 0.25)
  Top 0.152: v36.85,18.16 36.92,18.22 U$4.P$22
  Route15 0.152: v27.51,10.69 29.39,10.69 34.43,15.73 34.43,16.72 35.86,18.16 v36.85,18.16
  Bottom 0.152: v27.51,10.69 27.56,10.74 27.56,11.99 U3.19
SEG6  (via drill 0.25)
  Top 0.152: v35.13,18.06 36.02,18.95 U$4.P$21
  Route15 0.152: v28.02,11.16 29.44,11.16 34.13,15.85 34.13,16.82 35.13,17.83 v35.13,18.06
  Bottom 0.152: v28.02,11.16 28.02,12.23 U3.20
SEG7  (via drill 0.25)
  Top 0.152: v34.49,18.06 35.12,18.68 U$4.P$20
  Route15 0.152: v30.2,13.66 30.33,13.54 31.4,13.54 33.83,15.96 33.83,16.92 34.49,17.59 v34.49,18.06
  Bottom 0.152: v30.2,13.66 29.41,13.66 U3.24
SEG8  (via drill 0.25)
  Top 0.152: U$4.P$19 34.22,18.39 34.06,18.24 34.06,17.78 v33.76,17.48
  Route15 0.152: v30.68,13.99 31.44,13.99 33.53,16.08 33.53,17.25 v33.76,17.48
  Bottom 0.152: v30.68,13.99 30.58,14.1 29.69,14.1 U3.25
SEG9  (via drill 0.25)
  Top 0.152: U$4.P$18 33.32,16.55 v32,15.24
  Bottom 0.152: v32,15.24 31.28,14.45 30.04,14.45 U3.26
SEG10  (via drill 0.25)
  Top 0.152: U$4.P$17 32.42,16.31 v30.99,14.88
  Bottom 0.152: U3.27 29.98,15.23 30.48,14.73 30.95,14.73 v30.99,14.88
SEG11  (via drill 0.25)
  Top 0.152: U$4.P$16 31.52,18.39 v31.27,18.14
  Route15 0.152: v31.27,18.14 31.27,17.45 29.81,15.99 v29.38,15.99
  Bottom 0.152: U3.28 29.92,15.99 v29.38,15.99
SEG12  (via drill 0.25)
  Top 0.152: U$4.P$15 30.52,19.44 30.52,17.58 v30.63,17.48
  Bottom 0.152: U3.31 30.63,17.4 v30.63,17.48
SEG13  (via drill 0.25)
  Top 0.152: U$4.P$14 v29.72,18.24
  Bottom 0.152: v29.72,18.24 30.5,18.24 U3.32
SEG14  (via drill 0.25)
  Top 0.152: v28.57,18.01 28.82,18.25 U$4.P$13
  Route2 0.152: v28.57,18.01 28.74,17.84 29.34,17.84 30.24,16.94 v35.67,16.94 v35.68,16.95
  Bottom 0.152: U3.35 v35.67,16.96 v35.68,16.95
SEG15  (via drill 0.25)
  Top 0.152: v27.84,18.26 27.92,18.34 U$4.P$12
  Route2 0.152: v27.84,18.26 27.84,18.03 28.31,17.56 29.22,17.56 30.12,16.66 35.33,16.66 35.48,16.51 35.85,16.51 36.24,16.91 v36.24,17.11
  Bottom 0.152: v36.24,17.11 36.24,16.91 35.36,16.02 U3.36
SEG16  (via drill 0.25)
  Top 0.152: U$4.P$11 27.02,18.42 v27.18,18.26
  Route2 0.152: v27.18,18.26 28.16,17.28 29.1,17.28 30,16.38 35.22,16.38 35.37,16.23 36,16.23 36.65,16.88 36.66,16.88 v36.83,17.05
  Bottom 0.152: U3.37 36.4,16.27 36.4,16.63 36.65,16.88 36.66,16.88 v36.83,17.05
SEG17  (via drill 0.25)
  Top 0.152: U$4.P$10 26.12,18.33 v26.67,17.78
  Route2 0.152: v26.67,17.78 27.26,17.78 28.04,17 28.98,17 29.88,16.1 35.1,16.1 35.25,15.95 36.12,15.95 36.61,16.45 v36.83,16.45
  Bottom 0.152: U3.38 36.83,15.99 v36.83,16.45
SEG18  (via drill 0.25)
  Top 0.152: U$4.P$6 22.52,18.43 v23.24,17.7
  Route2 0.152: v35.57,14.21 34.59,13.23 30.01,13.23 28.89,14.35 27.56,14.35 24.36,17.55 23.39,17.55 v23.24,17.7
  Bottom 0.152: U3.39 35.76,14.21 v35.57,14.21
SEG19  (via drill 0.25)
  Top 0.152: U$4.P$5 21.62,18.39 22.58,17.42 v22.71,17.42
  Route2 0.152: v36.02,13.77 35.21,12.95 29.78,12.95 28.68,14.05 27.44,14.05 24.22,17.27 22.86,17.27 v22.71,17.42
  Bottom 0.152: 36.08,13.82 v36.02,13.77 | U3.40 36.08,13.82 | 36.08,13.82
SEG20  (via drill 0.25)
  Top 0.152: U$4.P$4 20.72,18.61 22.17,17.15 v22.17,17.14
  Route2 0.152: v36.12,13.16 35.62,12.66 29.59,12.66 28.5,13.76 27.32,13.76 24.09,16.99 22.33,16.99 v22.17,17.14
  Bottom 0.152: U3.41 36.43,13.47 | 36.43,13.47 | 36.43,13.47 v36.12,13.16
SEG21  (via drill 0.25)
  Top 0.152: U$4.P$3 19.82,18.57 21.55,16.84 v21.59,16.84
  Route2 0.152: v36.73,13.06 36.03,12.37 29.42,12.37 28.32,13.46 27.2,13.46 23.97,16.7 21.73,16.7 v21.59,16.84
  Bottom 0.152: U3.42 36.78,13.12 | 36.78,13.12 | 36.78,13.12 v36.73,13.06
SEG22  (via drill 0.25)
  Top 0.152: U$4.P$2 18.92,18.52 20.88,16.56 v21.06,16.56
  Route2 0.152: v36.83,12.45 36.45,12.07 29.24,12.07 28.15,13.17 27.09,13.17 23.85,16.41 21.21,16.41 v21.06,16.56
  Bottom 0.152: 37.14,12.76 v36.83,12.45 | U3.43 37.14,12.76 | 37.14,12.76
SEG23  (via drill 0.25)
  Top 0.152: U$4.P$1 18.02,18.53 20.42,16.13 v20.65,16.13
  Route2 0.152: v37.45,12.38 36.85,11.78 29.06,11.78 27.97,12.87 26.97,12.87 23.71,16.13 v20.65,16.13
  Bottom 0.152: U3.44 v37.46,12.38 v37.45,12.38
STAT
  Bottom 0.203: U2.1 17.37,16.76 15.15,16.76 R3.2
SWCLK  (via drill 0.25)
  Top 0.203: J3.4 48.26,12.95 v47.62,12.32
  Route2 0.203: v36.44,9.08 37.77,10.41 v43.74,10.41
  Route15 0.203: v43.74,10.41 43.56,10.41 40.31,13.66 40.31,20.65 JP4.10
  Bottom 0.203: v36.44,9.08 36.44,7.11 36.41,7.08 36.41,6.67 U3.57 | v43.74,10.41 43.94,10.62 R6.1 47.16,11.85 v47.62,12.32 TP6.P$1
SWDIO  (via drill 0.25)
  Top 0.203: J3.2 48.51,14.22 v47.5,13.21
  Route2 0.203: v43.69,9.14 42.75,10.08 38.09,10.08 36.63,8.62 35.98,8.62 v35.98,8.64 | v47.5,13.21 46.99,12.7 v46.99,9.14
  Route15 0.203: v43.69,9.14 43.69,9.8 39.95,13.54 39.95,18.47 JP4.9
  Bottom 0.203: U3.58 35.98,6.39 v35.98,8.64 | TP7.P$1 49.02,9.14 v46.99,9.14 v43.69,9.14
TX  (via drill 0.25)
  Route15 0.203: JP2.2 40.82,2.36 40.82,7.98 v40.34,8.46
  Bottom 0.203: U3.49 40.28,8.46 v40.34,8.46
USB_N  (via drill 0.25)
  Route2 0.203: v37.59,11.18 37.56,11.14 28.69,11.14 28.2,11.63 24.38,11.63 24.09,11.91 9.81,11.91 8.9,11.01 J1.A7 5.56,11.01 4.71,11.86 J1.B7
  Bottom 0.203: U3.45 37.59,11.8 v37.59,11.18
USB_P  (via drill 0.25)
  Route2 0.203: v38.05,11.62 38.03,11.63 37.17,11.63 37.01,11.47 28.85,11.47 27.75,12.57 26.42,12.57 26.15,12.84 24.4,12.84 24.13,12.57 9.56,12.57 8.85,11.86 J1.A6
  Route15 0.203: J1.A6 5.56,11.86 4.71,11.01 J1.B6
  Bottom 0.203: U3.46 38.11,11.62 v38.05,11.62
VBAT
  Top 0.305: JP4.1 16.51,20.14 11.97,15.6 J2.2
  Bottom 0.305: Q1.3 12.18,17.26 JP4.1 18.03,20.07 19.15,20.07 C4.1 20,18.37 U2.3
VBUS  (via drill 0.25)
  Route15 0.305: JP4.3 20.78,20.78 20.78,19.86 20.07,19.14 v20.07,14.73
  Bottom 0.305: CHG.A 1.91,5.59 3.08,6.76 3.08,7.97 4.42,9.3 | J1.A9 J1.B4 4.42,9.3 | v20.07,14.73 20.07,13.5 U2.4 18.76,12.19 15.9,12.19 14.48,10.77 R1.2 13.7,11.3 13.7,11.87 12.7,12.87 12.7,12.89 12.63,12.95 12.63,14.49 Q1.1 11.03,16.09 9.59,16.09 9.38,15.88 9.38,15.52 7.53,13.67 D1.A 7.7,13.27 7.42,13.55 J1.A4 J1.B9 4.21,13.31 4.2,13.31 3.85,12.96 3.85,9.9 4.42,9.34 4.42,9.3
VDDCORE
  Bottom 0.305: U3.53 39.2,6.71 L1.1 40.93,5.84 C10.1
VDDOUT
  Bottom 0.305: U3.55 38.63,5.87 L1.2
VHI
  Bottom 0.305: R2.2 17.87,9.99 17.27,9.4 17.27,7.87 16.58,7.18 U1.1 13.78,7.18 C1.1 13.27,7.56 13.27,11.63 D1.C 11.63,13.6 Q1.2
VLCD
  Bottom 0.203: C11.2 27.21,15.16 U3.23

### Text on the board
tPlace: EN | VBUS | PA12 | PA13 | PA01 | PA00 | PA27 | PA31 | PA30 | SCL | SDA | VBAT | LCD26 | LCD25 | LCD24 | LCD23 | LCD22 | LCD21 | LCD0 | LCD1 | LCD2 | LCD20 | LCD19 | LCD18 | LCD17 | LCD16 | LCD15 | LCD14 | LCD13 | LCD12 | LCD11 | LCD10 | LCD9 | LCD8 | LCD7 | LCD6 | LCD5 | LCD4 | LCD3 | SAM L22 / Feather with LCD / OSO-FEAL-A1-00 | RST | 3V | ARF | GND | A5 | A6 | A7 | A0 | A8 | A3 | SCK | MO | MI | RX | TX | NC
bPlace: VBAT | VBUS | LED / / / PA12 | PA13 | PA01 | PA00 | PA27 | SWDIO / PA31 | SWCLK / PA30 | SCL / PB31 | SDA / PB30 | SAM L22 / Feather with LCD / OSO-FEAL-A1-00 | EN | !RESET | SWCLK | TX: / PB22 | RX: / PB23 | 3V3 | A4/MISO: / PB00 | SWDIO | A1/SCK: / PB01 | GND | A2/ / MOSI: / PB02 | 3V3 | GND | A5 / PA07 | A6 / PA04 | !RESET | AREF / PA03 | A7 / PB05 | A0 / PB04 | A8 / PA02 | A3 / PB03